# Altium project FRONT-UNIT-7.PrjPcb
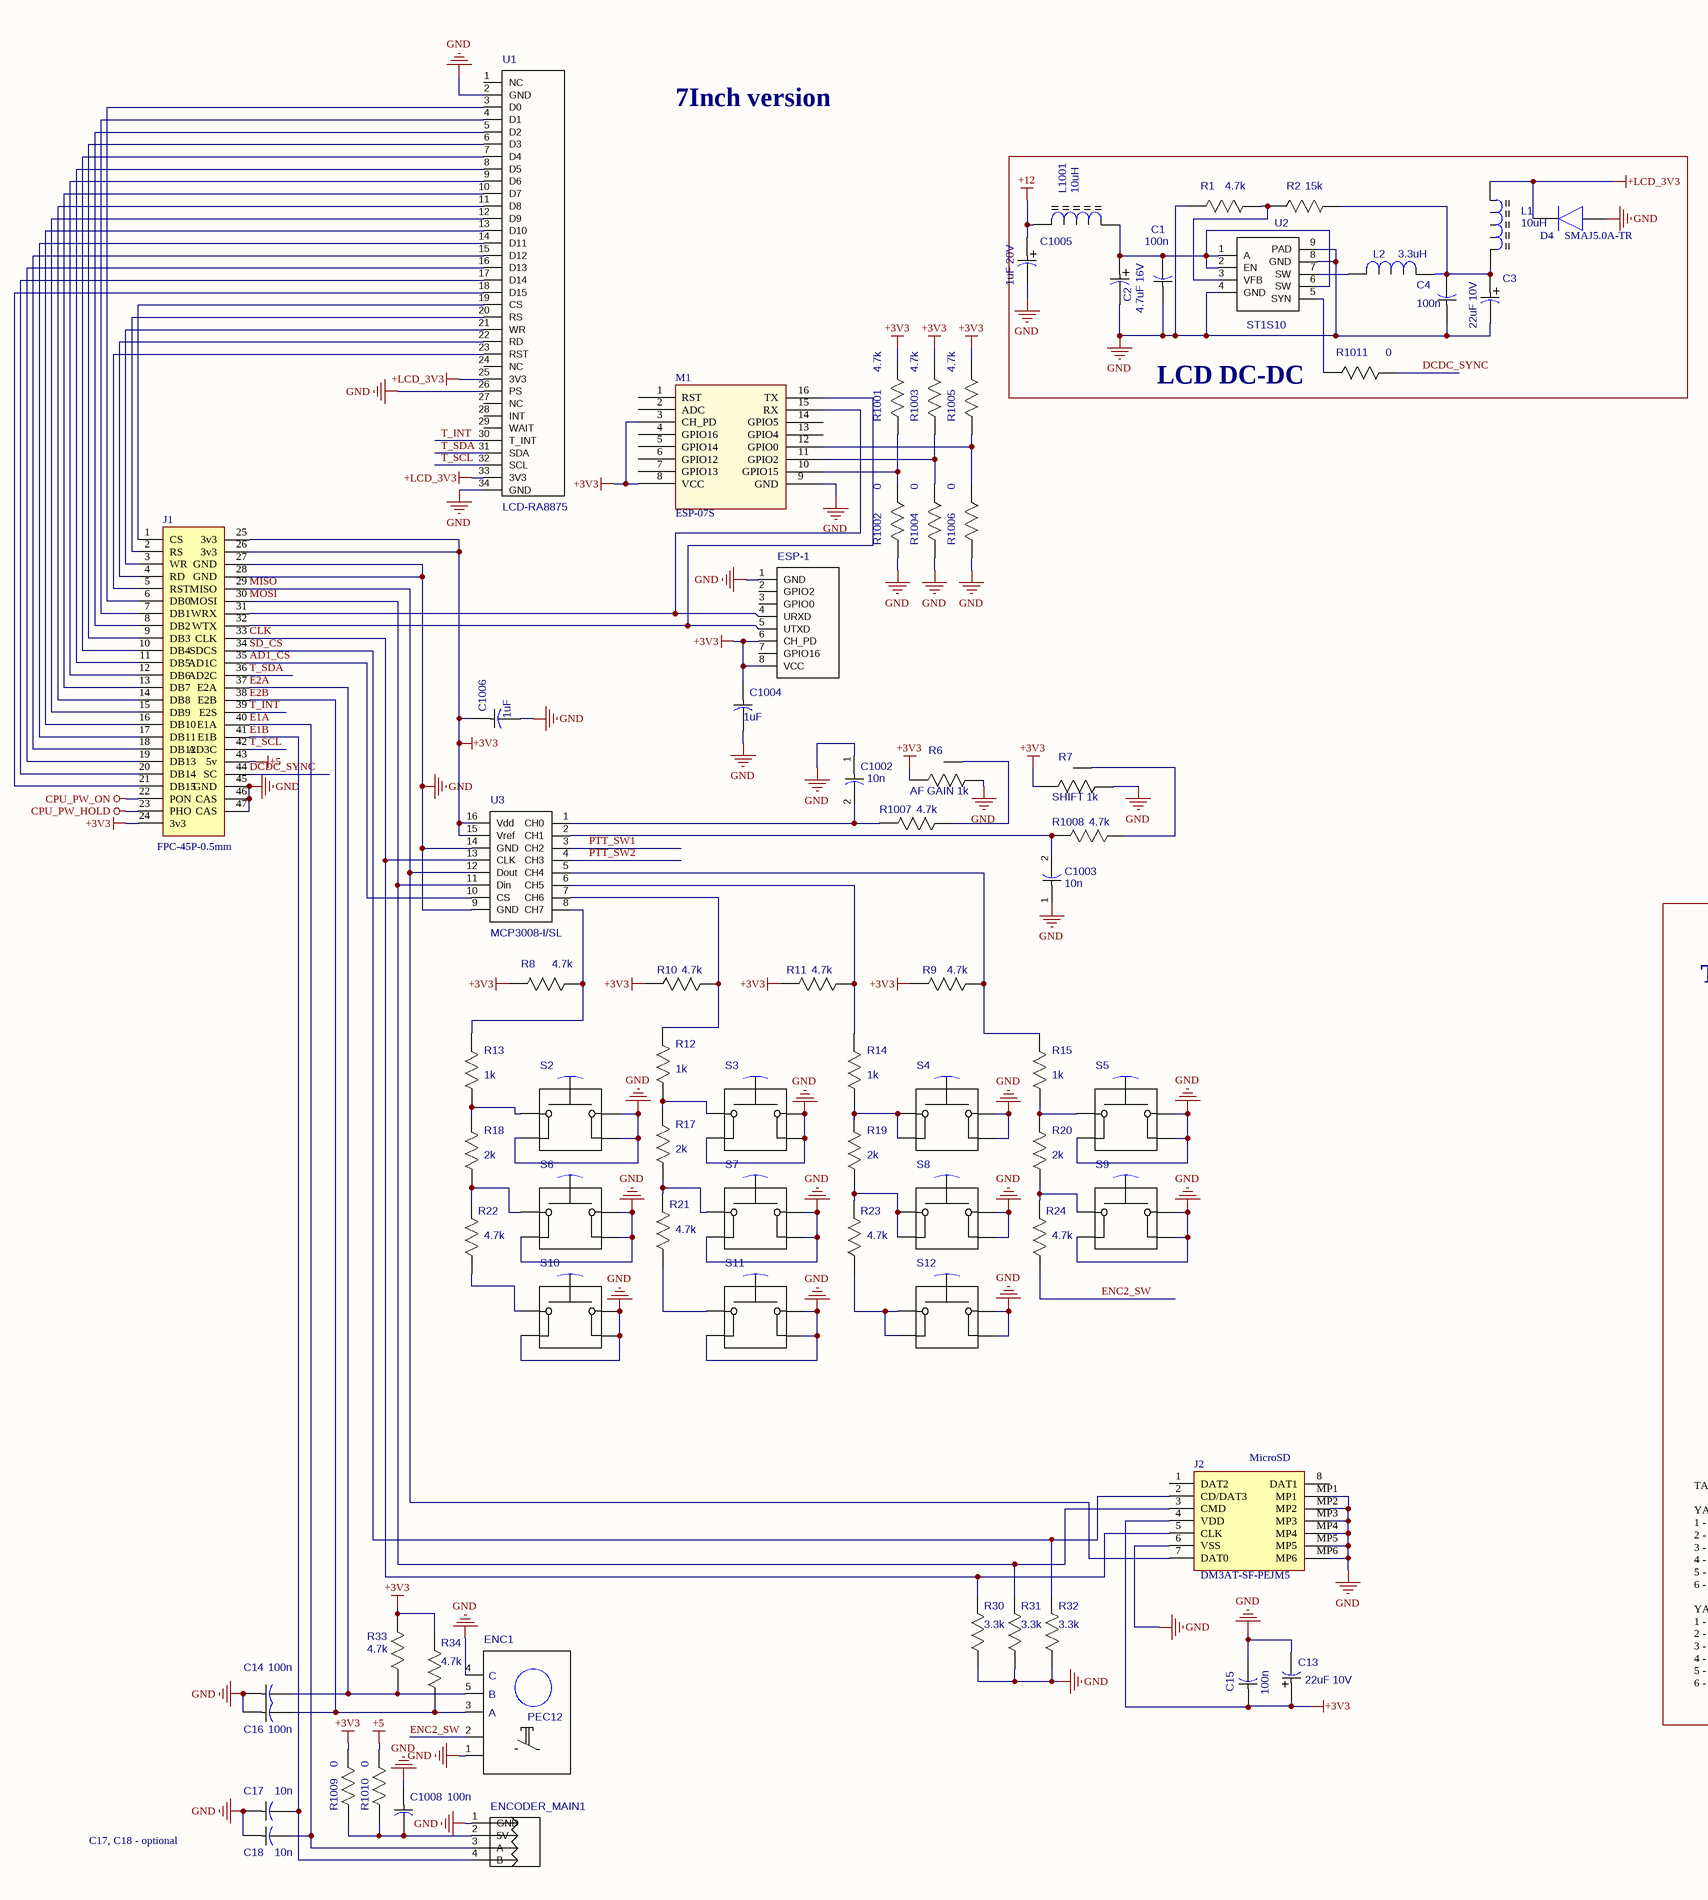
[diagram p0: FRONT-UNIT-7.SCHDOC, left]
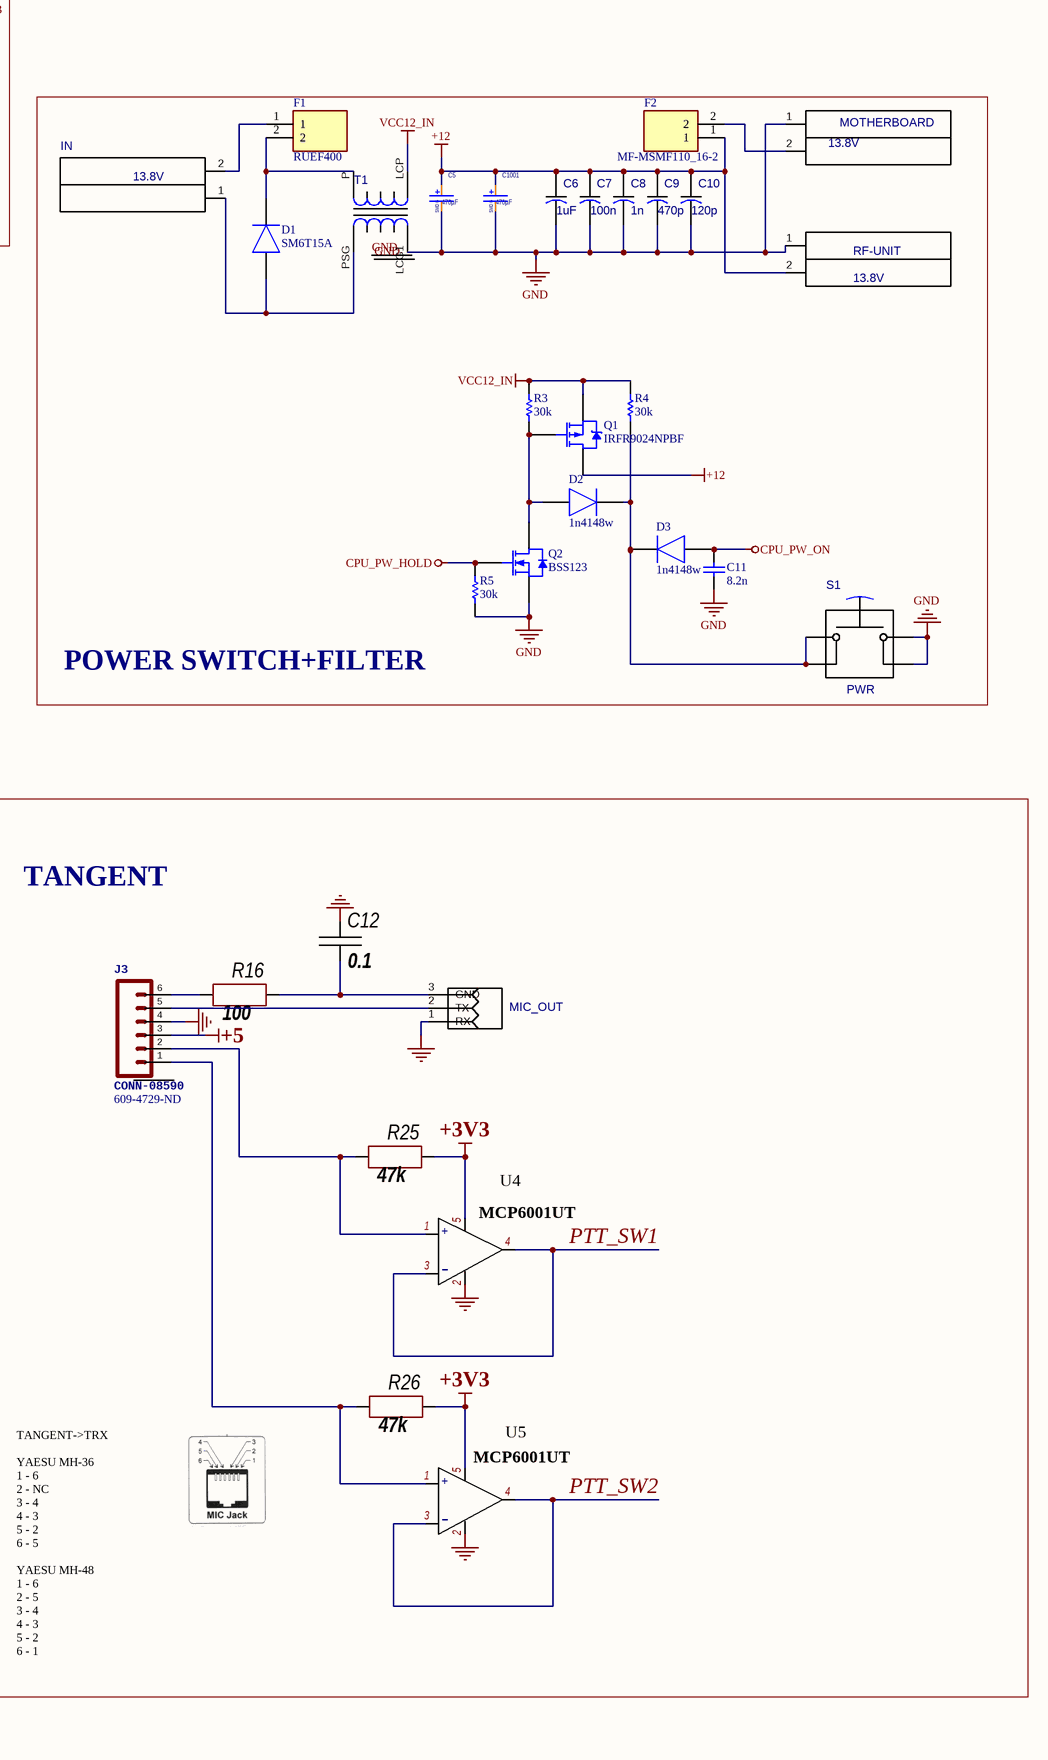
[diagram p1: FRONT-UNIT-7.SCHDOC, right]
1 sheet, 107 parts. Net scope: global (net labels, ports and power ports of the same name join across sheets).
Board file: FRONT-UNIT-7.PcbDoc

## Sheet FRONT-UNIT-7.SCHDOC: FRONT-UNIT-7INCH
size A2; DocumentNumber: 1; Revision: 2.0; SheetNumber: 1; SheetTotal: 18; DocumentName: Лист 1.SCHDOC

### Parts
C1  100n  [CAP_0805]
C2  4.7uF 16V  [SMC]
C3  22uF 10V  [CAPAE_4.3x4.3h5.4]
C4  100n  [CAP_0805]
C5  value 470µF  [SMD-G-10X10.2]  (hidden comment: 470uF 25V)
C6  1uF  [CAP_1206]
C7  100n  [CAP_1206]
C8  1n  [CAP_1206]
C9  470p  [CAP_1206]
C10  120p  [CAP_1206]
C11  8.2n  [CAPC2013X94X50LL20T25]
C12  0.1  [CH0805C]
C13  22uF 10V  [EEEFC_sizeB]
C14  100n  [CAP_0805]
C15  100n  [CAP_0805]
C16  100n  [CAP_0805]
C17  10n  [CAP_0805]
C18  10n  [CAP_0805]
C1001  value 470µF  [SMD-G-10X10.2]  (hidden comment: 470uF 25V)
C1002  10n  [CAP_0805]
C1003  10n  [CAP_0805]
C1004  1uF  [CAP_1206]
C1005  1uF 20V  [CAPAE_4.3x4.3h5.4]
C1006  1uF  [CAP_1206]
C1008  100n  [CAP_0805]
D1  SM6T15A  [SMBJ36CATR]
D2  1n4148w  [SOD3716X135N]
D3  1n4148w  [SOD3716X135N]
D4  SMAJ5.0A-TR  [SMBJ36CATR]
ENC1  PEC12  [PEC12]
ENCODER_MAIN1  OPTICAL ENCODER  [644456-4]  (value not drawn)
ESP-1  ESP-01 ESP8266  [ESP-01 ESP8266]  (value not drawn)
F1  RUEF400  [RUEF400]
F2  MF-MSMF110_16-2  [FUSC4632X85N]
IN  value 13.8V  [JX2]  (hidden comment: JX2)
J1  FPC-45P-0.5mm  [FH12S45S05SH60]
J2  DM3AT-SF-PEJM5  [DM3ATSFPEJM5]
J3  CONN-08590  Supplier Part Number 1: 609-4729-ND  [RJ11-6]
L1  10uH  [IND_7x7]
L2  3.3uH  [IND_1812]
L1001  10uH  [IND_7x7]
M1  ESP-07S  [ESP-07S]
MIC_OUT  51022-0300  [51022-0200 - duplicate]  (value not drawn)
MOTHERBOARD  value 13.8V  [JX2]  (hidden comment: JX2)
Q1  IRFR9024NPBF  [ONSC-DPAK-3-369C-01_V]
Q2  BSS123  [FAIR-SOT23-3_V]
R1  4.7k  [RES_0805]
R2  15k  [RES_0805]
R3  30k  [RESC2013X60X40NL20T25]
R4  30k  [RESC2013X60X40NL20T25]
R5  30k  [RESC2013X60X40NL20T25]
R6  value AF GAIN 1k  [PTV09]  (hidden comment: ptv09a-4225f-b102)
R7  value SHIFT 1k  [PTV09]  (hidden comment: ptv09a-4225f-b102)
R8  4.7k  [RES_0805]
R9  4.7k  [RES_0805]
R10  4.7k  [RES_0805]
R11  4.7k  [RES_0805]
R12  1k  [RES_0805]
R13  1k  [RES_0805]
R14  1k  [RES_0805]
R15  1k  [RES_0805]
R16  100  [CH0805R]
R17  2k  [RES_0805]
R18  2k  [RES_0805]
R19  2k  [RES_0805]
R20  2k  [RES_0805]
R21  4.7k  [RES_0805]
R22  4.7k  [RES_0805]
R23  4.7k  [RES_0805]
R24  4.7k  [RES_0805]
R25  47k  [CH0805R]
R26  47k  [CH0805C]
R30  3.3k  [RES_0805]
R31  3.3k  [RES_0805]
R32  3.3k  [RES_0805]
R33  4.7k  [RES_0805]
R34  4.7k  [RES_0805]
R1001  4.7k  [RES_0805]
R1002  0  [RES_0805]
R1003  4.7k  [RES_0805]
R1004  0  [RES_0805]
R1005  4.7k  [RES_0805]
R1006  0  [RES_0805]
R1007  4.7k  [RES_0805]
R1008  4.7k  [RES_0805]
R1009  0  [RES_0805]
R1010  0  [RES_0805]
R1011  0  [RES_0805]
RF-UNIT  value 13.8V  [JX2]  (hidden comment: JX2)
S1  value PWR  [PTS645SK50LFS]  (hidden comment: PTS645SK50LFS)
S2  PTS645SK50LFS  [L-X]  (value not drawn)
S3  PTS645SK50LFS  [L-X]  (value not drawn)
S4  PTS645SK50LFS  [PTS645SK50LFS]  (value not drawn)
S5  PTS645SK50LFS  [L-X]  (value not drawn)
S6  PTS645SK50LFS  [L-X]  (value not drawn)
S7  PTS645SK50LFS  [L-X]  (value not drawn)
S8  PTS645SK50LFS  [PTS645SK50LFS]  (value not drawn)
S9  PTS645SK50LFS  [L-X]  (value not drawn)
S10  PTS645SK50LFS  [L-X]  (value not drawn)
S11  PTS645SK50LFS  [L-X]  (value not drawn)
S12  PTS645SK50LFS  [PTS645SK50LFS]  (value not drawn)
T1  TRANSF_ICORE  [TRANSF_ICORE]  (value not drawn)
U1  LCD-RA8875  [LCD-RA8875]
U2  ST1S10  [ST1S10]
U3  MCP3008-I/SL  [MCP3008-I/SL]
U4  MCP6001UT  [SOT23-5]
U5  MCP6001UT  [SOT23-5]

### Blocks framed on the sheet
LCD DC-DC: C1-C4 C1005 D4 L1 L2 L1001 R1 R2 R1011 U2
POWER SWITCH+FILTER: C5-C11 C1001 D1-D3 F1 F2 IN MOTHERBOARD Q1 Q2 R3-R5 RF-UNIT S1 T1
TANGENT: C12 J3 MIC_OUT R16 R25 R26 U4 U5

### Nets
+3V3: C13.1(PLUS) C15.1 C1004.1 C1006.1 ESP-1.6(CH_PD) ESP-1.8(VCC) J1.24(3v3) J1.25(3v3) J1.26(3v3) J2.4(VDD) M1.3(CH_PD) M1.8(VCC) R6.1(CW) R7.1(CW) R8.2 R9.2 R10.2 R11.2 R25.2 R26.2 R33.2 R34.2 R1001.1 R1003.1 R1005.1 R1009.2 U3.15(Vref) U3.16(Vdd) U4.5 U5.5
+5: J1.43(5v) J3.3 R1010.2
+12: C5.1 C6.1 C7.1 C8.1 C9.1 C10.1 C1001.1 C1005.1(PLUS) F2.1 L1001.1(A) Q1.4(D) RF-UNIT.2
+LCD_3V3: D4.1(K) L1.1(A) U1.25(3V3) U1.33(3V3)
CPU_PW_HOLD: J1.23(PHO) Q2.1(G) R5.2
CPU_PW_ON: C11.2 D3.2(A) J1.22(PON)
GND: C1.1 C2.2(MINUS) C3.2(MINUS) C4.1 C5.2 C6.2 C7.2 C8.2 C9.2 C10.2 C11.1 C12.1 C13.2(MINUS) C14.1 C15.2 C16.1 C17.1 C18.1 C1001.2 C1002.1 C1003.1 C1004.2 C1005.2(MINUS) C1006.2 C1008.1 D4.2(A) ENC1.1 ENC1.4(C) ENCODER_MAIN1.1(GND) ESP-1.1(GND) J1.27(GND) J1.28(GND) J1.45(GND) J1.46(CAS) J1.47(CAS) J2.6(VSS) J2.MP1 J2.MP2 J2.MP3 J2.MP4 J2.MP5 J2.MP6 J3.4 M1.9(GND) MIC_OUT.1(RX) MOTHERBOARD.1 Q2.2(S) R1.1 R5.1 R6.3(CCW) R7.3(CCW) R30.1 R31.1 R32.1 R1002.2 R1004.2 R1006.2 RF-UNIT.1 S1.3(B) S1.4(B) S2.2(A) S2.3(B) S2.4(B) S3.2(A) S3.3(B) S3.4(B) S4.3(B) S4.4(B) S5.2(A) S5.3(B) S5.4(B) S6.2(A) S6.3(B) S6.4(B) S7.2(A) S7.3(B) S7.4(B) S8.3(B) S8.4(B) S9.2(A) S9.3(B) S9.4(B) S10.2(A) S10.3(B) S10.4(B) S11.2(A) S11.3(B) S11.4(B) S12.3(B) S12.4(B) T1.LCG1(S2) T1.LCG2 T1.LCG3 U1.2(GND) U1.26(PS) U1.34(GND) U2.4(GND) U2.8(GND) U2.9(PAD) U3.9(GND) U3.14(GND) U4.2 U5.2
VCC12_IN: Q1.3(S) R3.2 R4.2 T1.LCP(P2)
AD1_CS: J1.35(AD1C) U3.10(CS)
CLK: J1.33(CLK) J2.5(CLK) R30.2 U3.13(CLK)
DCDC_SYNC: J1.44(SC) R1011.2
E1A: C18.2 ENCODER_MAIN1.3(A) J1.40(E1A)
E1B: C17.2 ENCODER_MAIN1.4(B) J1.41(E1B)
E2A: C14.2 ENC1.5(B) J1.37(E2A) R33.1
E2B: C16.2 ENC1.3(A) J1.38(E2B) R34.1
ENC2_SW: ENC1.2 R24.1
MISO: J1.29(MISO) J2.7(DAT0) U3.12(Dout)
MOSI: J1.30(MOSI) J2.3(CMD) R31.2 U3.11(Din)
PTT_SW1: U3.3(CH2) U4.3 U4.4
PTT_SW2: U3.4(CH3) U5.3 U5.4
SD_CS: J1.34(SDCS) J2.2(CD/DAT3) R32.2
T_INT: J1.39(E2S) U1.30(T_INT)
T_SCL: J1.42(AD3C) U1.32(SCL)
T_SDA: J1.36(AD2C) U1.31(SDA)
NetC1_2: C1.2 C2.1(PLUS) L1001.2(B) U2.1(A) U2.2(EN) U2.6(SW)
NetC3_1: C3.1(PLUS) C4.2 L1.2(B) L2.2 R2.2
NetC12_2: C12.2 MIC_OUT.3(GND) R16.2
NetC1002_2: C1002.2 R1007.2 U3.1(CH0)
NetC1003_2: C1003.2 R1008.2 U3.2(CH1)
NetC1008_2: C1008.2 ENCODER_MAIN1.2(5V) R1009.1 R1010.1
NetD1_1: D1.1(K) F1.2 T1.P(P1)
NetD1_2: D1.2(A) IN.1 T1.PSG(S1)
NetD2_1: D2.1(K) D3.1(K) R4.1 S1.1(A) S1.2(A)
NetD2_2: D2.2(A) Q1.1(G) Q2.3(D) R3.1
NetESP-1_4: ESP-1.4(URXD) J1.31(WRX) M1.15(RX)
NetESP-1_5: ESP-1.5(UTXD) J1.32(WTX) M1.16(TX)
NetF1_1: F1.1 IN.2
NetF2_2: F2.2 MOTHERBOARD.2
NetJ1_1: J1.1(CS) U1.19(CS)
NetJ1_2: J1.2(RS) U1.20(RS)
NetJ1_3: J1.3(WR) U1.21(WR)
NetJ1_4: J1.4(RD) U1.22(RD)
NetJ1_5: J1.5(RST) U1.23(RST)
NetJ1_6: J1.6(DB0) U1.3(D0)
NetJ1_7: J1.7(DB1) U1.4(D1)
NetJ1_8: J1.8(DB2) U1.5(D2)
NetJ1_9: J1.9(DB3) U1.6(D3)
NetJ1_10: J1.10(DB4) U1.7(D4)
NetJ1_11: J1.11(DB5) U1.8(D5)
NetJ1_12: J1.12(DB6) U1.9(D6)
NetJ1_13: J1.13(DB7) U1.10(D7)
NetJ1_14: J1.14(DB8) U1.11(D8)
NetJ1_15: J1.15(DB9) U1.12(D9)
NetJ1_16: J1.16(DB10) U1.13(D10)
NetJ1_17: J1.17(DB11) U1.14(D11)
NetJ1_18: J1.18(DB12) U1.15(D12)
NetJ1_19: J1.19(DB13) U1.16(D13)
NetJ1_20: J1.20(DB14) U1.17(D14)
NetJ1_21: J1.21(DB15) U1.18(D15)
NetJ3_1: J3.1 R26.1 U5.1
NetJ3_2: J3.2 R25.1 U4.1
NetJ3_5: J3.5 MIC_OUT.2(TX)
NetJ3_6: J3.6 R16.1
NetL2_1: L2.1 U2.7(SW)
NetM1_10: M1.10(GPIO15) R1001.2 R1002.1
NetM1_11: M1.11(GPIO2) R1003.2 R1004.1
NetM1_12: M1.12(GPIO0) R1005.2 R1006.1
NetR1_2: R1.2 R2.1 U2.3(VFB)
NetR6_2: R6.2(W) R1007.1
NetR7_2: R7.2(W) R1008.1
NetR8_1: R8.1 R13.2 U3.8(CH7)
NetR9_1: R9.1 R15.2 U3.5(CH4)
NetR10_1: R10.1 R12.2 U3.7(CH6)
NetR11_1: R11.1 R14.2 U3.6(CH5)
NetR12_1: R12.1 R17.2 S3.1(A)
NetR13_1: R13.1 R18.2 S2.1(A)
NetR14_1: R14.1 R19.2 S4.1(A) S4.2(A)
NetR15_1: R15.1 R20.2 S5.1(A)
NetR17_1: R17.1 R21.2 S7.1(A)
NetR18_1: R18.1 R22.2 S6.1(A)
NetR19_1: R19.1 R23.2 S8.1(A) S8.2(A)
NetR20_1: R20.1 R24.2 S9.1(A)
NetR21_1: R21.1 S11.1(A)
NetR22_1: R22.1 S10.1(A)
NetR23_1: R23.1 S12.1(A) S12.2(A)
NetR1011_1: R1011.1 U2.5(SYN)

Not connected (* = marked no-connect by the designer): ESP-1 2(GPIO2) 3(GPIO0) 7(GPIO16); J2 1(DAT2) 8(DAT1); J3 0; M1 1(RST) 2(ADC) 4(GPIO16) 5(GPIO14) 6(GPIO12) 7(GPIO13) 13(GPIO4) 14(GPIO5); U1 1(NC) 24(NC) 27(NC) 28(INT) 29(WAIT)

### Notes on the sheet
- 7Inch version
- (near J2) MicroSD
- TANGENT->TRX
  YAESU MH-36
  1 - 6
  2 - NC
  3 - 4
  4 - 3
  5 - 2
  6 - 5
  YAESU MH-48
  1 - 6
  2 - 5
  3 - 4
  4 - 3
  5 - 2
  6 - 1
- С17, C18 - optional
- Title
- Size:
- Date:
- File:
- A2
- Number:
- Time:
- Revision:
- Sheet
- of
- (in symbol MCP6001UT_1) +; -
- (in symbol SMD-G 470uF 25V) SMD G

### Library data of the parts
C1 C4 C14-C18 C1002 C1003 C1008 = CAP_0805
  C1 C4 C14-C16 C1008: Value: 100n
  C1002 C1003: Value: *
C2 = CAPAE_6.6x6.6h5.4: Value: 4.7uF 16V
C3 C1005 = CAPAE_4.3x4.3h5.4
  C3: Value: 22uF 10V
  C1005: Value: 1uF 20V
C5 C1001 = SMD-G 470uF 25V: CAP ALUM 470UF 20% 25V SMD; Manufacturer: KEMET; Manufacturer PartNumber: EDH477M025A9PAA; Pricing Аlternative: 0.05; Temp.Characteristic: –55 °C to +105 °C; Note: Aluminum Electrolytic Capacitors; Detailed Description: 470µF 25V Aluminum Electrolytic Capacitors Radial, Can - SMD  2000 Hrs @ 105°C; Lifetime @ Temp: 2000Hrs@105℃; ComponentLink2URL: http://www.mouser.com/ds/2/315/ABA0000C1181-947564.pdf; Dealer Digi-Key: https://www.digikey.com/product-detail/en/kemet/EDH477M025A9PAA/EDH477M025A9PAA-ND/6597660; Dealer Аlternative: https://detail.1688.com/offer/541866342432.html; Package / Case: G, 0.394" Dia (10.00mm); Pricing Digi-Key: 0.21; Publisher: Catcatcat Electronics; Tolerance: ±20 %; Voltage: 25V; HelpURL: https://api.kemet.com/component-edge/download/datasheet/EDH477M025A9PAA.pdf; website developer: http://catcatcat.d-lan.dp.ua/; PartNumber Digi-Key: EDH477M025A9PAA; Assembly type: Manual Part
C6-C10 C1004 C1006 = CAP_1206
  C6 C1004 C1006: Value: 1uF
  C7: Value: 100n
  C8: Value: 1n
C11 = CMP-2007-04444-1: CAP_1206; Manufacturer: AVX Interconnect / Elco; Part Number: 08055C822KAT2A
C12 = Capacitor: Manufacturer: *; Model: *; HelpURL: *; ComponentKind: *; Value: *
C13 = EEEFC_sizeB: Value: 22uF 10V
D1 = SM6T15A: Diode; Manufacturer_Name: STMicroelectronics; Allied_Number: 70390432; Datasheet Link: http://www.st.com/web/en/resource/technical/document/datasheet/CD00000725.pdf; Height: 2.65mm; Manufacturer_Part_Number: SM6T15A; Mouser Part Number: 511-SM6T15A; Mouser Price/Stock: https://www.mouser.com/Search/Refine.aspx?Keyword=511-SM6T15A; RS Part Number: 4864915P; RS Price/Stock: http://uk.rs-online.com/web/p/products/4864915P; Allied Price/Stock: http://www.alliedelec.com/stmicroelectronics-sm6t15a/70390432/
D2 D3 = 1n4148w: Diode; Manufacturer_Name: Vishay; Datasheet Link: http://www.vishay.com/docs/85748/1n4148w.pdf; Height: 1.35mm; Manufacturer_Part_Number: 1n4148w
D4 = SMLVT3V3: Diode; Manufacturer_Name: STMicroelectronics; Allied_Number: 70013736; Datasheet Link: http://www.st.com/web/en/resource/technical/document/datasheet/CD00000923.pdf; Height: 2.65mm; Manufacturer_Part_Number: SMLVT3V3; Mouser Part Number: 511-SMLVT3V3; Mouser Price/Stock: https://www.mouser.com/Search/Refine.aspx?Keyword=511-SMLVT3V3; RS Part Number: 5444821P; RS Price/Stock: http://uk.rs-online.com/web/p/products/5444821P; Allied Price/Stock: http://www.alliedelec.com/stmicroelectronics-smlvt3v3/70013736/; LCSC Part #: test
ENC1 = PEC12: FULLNAME: Выключатель замыкающий с приводом нажатием кнопки; Value: PEC12
ENCODER_MAIN1 = 644456-4
F1 = RUEF400: Fuse; Manufacturer_Name: LITTELFUSE; Datasheet Link: https://componentsearchengine.com/Datasheets/1/RUEF400.pdf; Height: 19mm; Manufacturer_Part_Number: RUEF400; Mouser Part Number: 650-RUEF400; Mouser Price/Stock: https://www.mouser.co.uk/ProductDetail/Littelfuse/RUEF400?qs=hv6pn79dJPQHuFVnpNF%2FDg%3D%3D; RS Part Number: 5176837P; RS Price/Stock: http://uk.rs-online.com/web/p/products/5176837P
F2 = MF-MSMF110_16-2: Fuse; Manufacturer_Name: Bourns; Manufacturer_Part_Number: MF-MSMF110/16-2; Allied_Number: 70153434; Datasheet Link: https://componentsearchengine.com/Datasheets/2/MF-MSMF110_16-2.pdf; Height: 0.85mm; Mouser Part Number: 652-MF-MSMF110/16-2; Mouser Price/Stock: https://www.mouser.co.uk/ProductDetail/Bourns/MF-MSMF110-16-2?qs=wksszfECgvir54ST3ixUHA%3D%3D; RS Part Number: 6478207P; RS Price/Stock: http://uk.rs-online.com/web/p/products/6478207P; Allied Price/Stock: https://www.alliedelec.com/bourns-mf-msmf110-16-2/70153434/
J1 = FH12S-45S-0.5SH_55_: Connector; Manufacturer_Name: Hirose; Manufacturer_Part_Number: FH12S-45S-0.5SH(55); Datasheet Link: https://www.hirose.com/product/en/download_file/key_name/FH12S-45S-0.5SH%2855%29/category/Drawing%20(2D)/doc_file_id/43881/?file_category_id=6&item_id=05860665055&is_series=; Height: 2mm; Mouser Part Number: 798-FH12S-45S-05SH55; Mouser Price/Stock: https://www.mouser.co.uk/ProductDetail/Hirose-Connector/FH12S-45S-05SH55?qs=0N%252BVULUZFj%252BE0LA99Ny0NA%3D%3D; RS Part Number: 1620942; RS Price/Stock: http://uk.rs-online.com/web/p/products/1620942
J2 = DM3AT-SF-PEJM5: Connector; Manufacturer_Name: HRS(Hirose); Datasheet Link: https://datasheet.lcsc.com/szlcsc/Hirose-HRS-DM3AT-SF-PEJM5_C114218.pdf; Height: 1.83mm; Manufacturer_Part_Number: DM3AT-SF-PEJM5
J3 = RJ11-6: RJ11 6P6C; SF_ID: PRT-00132; PROD_ID: CONN-08590; Supplier 1: Digi-Key
L1 L1001 = IND_FERRITE_CORE: Inductor; Value: 10uH
L2 = IND_1812: Value: 3.3uH
Q1 = CMP-1058-00387-1: IRFR9024NPBF, Транзистор, Р-канал 55В 11А; Manufacturer: On Semiconductor; PartNumber: NTD2955G; Ciss Typ (pF): 500; Qrr Typ (nC): 100; VGS Max (V): 20; PD Max (W): 55; Channel Polarity: P Channel; V(BR)DSS Min (V): 60; ID Max (A): 12; Configuration: Single; Crss Typ (pF): 50; Packing: Tape and Reel; VGS(th) Max (V): 4; Coss Typ (pF): 150; RoHS: Pb-Free; ComponentLink1Description: Manufacturer URL; Mounting Technology: Surface Mount; ComponentLink2URL: http://www.onsemi.cn/pub_link/Collateral/NTD2955-D.PDF; PackageDescription: 3-Pin Flange Mount, Body 6.54 x 6.095 mm, Pitch 2.29 mm; ComponentLink3Description: Package Specification; Package Type: DPAK-3, IPAK-4; ComponentLink3URL: http://www.onsemi.cn/pub_link/Collateral/369C.PDF; DatasheetVersion: Rev. 13; ComponentLink2Description: Datasheet; ComponentLink1URL: http://www.onsemi.com/; PackageVersion: Rev. E, 02/2014; PackageReference: DPAK-3-369C-01
Q2 = CMP-2000-04934-1: N-Channel Logic Level Enhancement Mode Field Effect Transistor, 1.7 V, -55 to 150 degC, 3-Pin SOT-23, RoHS, Tape and Reel; Manufacturer: Fairchild; Channel Type: N; Typical Turn-Off Delay Time: 17ns; Maximum Continuous Drain Current: 0.17A; Rad Hard: No; Typical Rise Time: 9ns; Typical Fall Time: 2.4ns; Maximum Gate Source Voltage: ±20V; Maximum Drain Source Voltage: 100V; Typical Turn-On Delay Time: 1.7ns; RDS-on: 6000@10VmOhm; Package Version: Rev. 12, 03/2016; Packaging: Tape&Reel; Package Reference: SOT23-3; Channel Mode: Enhancement; Operating Temperature: -55to150degC; Package Description: 3-Pin Small Outline Transistor, Body 2.92 x 1.325 mm, Pitch 0.95 mm; Category: MOSFET; Datasheet Version: Jun-03; Datasheet URL: https://www.fairchildsemi.com/datasheets/BS/BSS123.pdf; Manufacturer URL: https://www.fairchildsemi.com/; Mounting: SurfaceMount; Package: 3SOT-23; Package URL: http://www.fairchildsemi.com/dwg/MA/MA03D.pdf
R1 R2 R8-R15 R17-R24 R30-R34 R1001-R1011 = RES_0805
  R8-R11 R33 R34 R1001 R1003 R1005 R1007 R1008: Value: 4.7k
  R30-R32: Value: 3.3k
  R1002 R1004 R1006 R1009 R1010: Value: 0
R3-R5 = CMP-2001-00626-1: RES_0805; Manufacturer: Panasonic; Part Number: ERA-6AEB303V
R6 R7 = PTV09: Adjustable Resistor PTV09
R16 R25 R26 = Resistor: Manufacturer: *; Model: *; HelpURL: *; ComponentKind: *; Value: *
U4 U5 = MCP6001UT_1
ESP-1 = ESP-01 ESP8266: Value: ESP-01 ESP8266
MIC_OUT = 51022-0300: Value: *
S1-S12 = PTS645SK50LFS
  S2: LCSC Part #: test
T1 = TRANSF_ICORE: Value: *
U1 = LCD-RA8875: Value: *
U2 = ST1S10: Value: ST1S10
U3 = MCP3008-I/SL: Value: MCP3008-I/SL